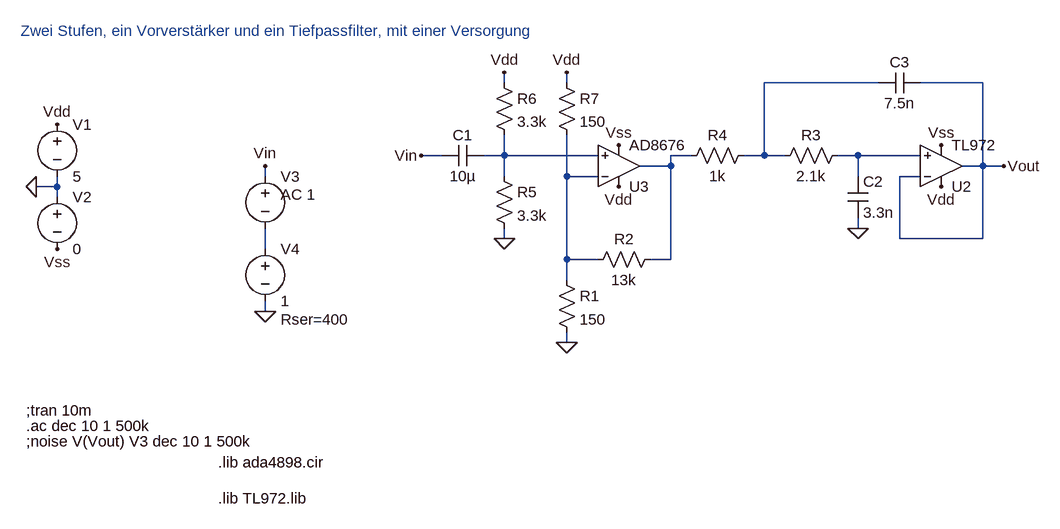
[diagram p0: schematic zwei_stufen_einfachversorgung.asc]
zwei_stufen_einfachversorgung.asc, the LTspice schematic file:
Version 4
SHEET 1 1096 5076
WIRE 144 -64 144 -80
WIRE 240 -64 240 -80
WIRE 720 -64 544 -64
WIRE 880 -64 784 -64
WIRE 48 48 16 48
WIRE 144 48 144 16
WIRE 144 48 112 48
WIRE 288 48 144 48
WIRE 432 48 400 48
WIRE 544 48 544 -64
WIRE 544 48 512 48
WIRE 576 48 544 48
WIRE 688 48 656 48
WIRE 784 48 688 48
WIRE 400 64 400 48
WIRE 400 64 352 64
WIRE 880 64 880 -64
WIRE 880 64 848 64
WIRE 912 64 880 64
WIRE -224 80 -224 64
WIRE 144 80 144 48
WIRE 240 80 240 16
WIRE 288 80 240 80
WIRE 688 80 688 48
WIRE 784 80 752 80
WIRE -544 96 -544 80
WIRE -544 96 -576 96
WIRE -544 112 -544 96
WIRE 688 160 688 144
WIRE 144 176 144 160
WIRE 752 176 752 80
WIRE 880 176 880 64
WIRE 880 176 752 176
WIRE -224 192 -224 160
WIRE 240 208 240 80
WIRE 288 208 240 208
WIRE 400 208 400 64
WIRE 400 208 368 208
WIRE 240 240 240 208
WIRE -224 288 -224 272
WIRE 240 336 240 320
FLAG -544 0 Vdd
FLAG -576 96 0
FLAG -544 192 Vss
FLAG 320 96 Vdd
FLAG 320 32 Vss
FLAG 240 336 0
FLAG -224 288 0
FLAG 16 48 Vin
FLAG -224 64 Vin
FLAG 816 96 Vdd
FLAG 816 32 Vss
FLAG 688 160 0
FLAG 912 64 Vout
FLAG 144 176 0
FLAG 144 -80 Vdd
FLAG 240 -80 Vdd
SYMBOL voltage -544 -16 R0
WINDOW 123 0 0 Left 0
WINDOW 39 0 0 Left 0
SYMATTR InstName V1
SYMATTR Value 5
SYMBOL voltage -544 96 R0
WINDOW 123 0 0 Left 0
WINDOW 39 0 0 Left 0
SYMATTR InstName V2
SYMATTR Value 0
SYMBOL res 224 224 R0
SYMATTR InstName R1
SYMATTR Value 150
SYMBOL res 384 192 R90
WINDOW 0 0 56 VBottom 2
WINDOW 3 32 56 VTop 2
SYMATTR InstName R2
SYMATTR Value 13k
SYMBOL voltage -224 64 R0
WINDOW 3 24 96 Invisible 2
WINDOW 123 24 44 Left 2
WINDOW 39 0 0 Left 0
SYMATTR Value SINE(0 10m 1k)
SYMATTR Value2 AC 1
SYMATTR InstName V3
SYMBOL voltage -224 176 R0
WINDOW 123 0 0 Left 0
WINDOW 39 24 124 Left 2
SYMATTR SpiceLine Rser=400
SYMATTR InstName V4
SYMATTR Value 1
SYMBOL cap 112 32 R90
WINDOW 0 0 32 VBottom 2
WINDOW 3 32 32 VTop 2
SYMATTR InstName C1
SYMATTR Value 10µ
SYMBOL cap 672 80 R0
SYMATTR InstName C2
SYMATTR Value 3.3n
SYMBOL res 672 32 R90
WINDOW 0 0 56 VBottom 2
WINDOW 3 32 56 VTop 2
SYMATTR InstName R3
SYMATTR Value 2.1k
SYMBOL res 528 32 R90
WINDOW 0 0 56 VBottom 2
WINDOW 3 32 56 VTop 2
SYMATTR InstName R4
SYMATTR Value 1k
SYMBOL cap 784 -80 R90
WINDOW 0 0 32 VBottom 2
WINDOW 3 32 32 VTop 2
SYMATTR InstName C3
SYMATTR Value 7.5n
SYMBOL res 128 64 R0
SYMATTR InstName R5
SYMATTR Value 3.3k
SYMBOL res 128 -80 R0
SYMATTR InstName R6
SYMATTR Value 3.3k
SYMBOL res 224 -80 R0
SYMATTR InstName R7
SYMATTR Value 150
SYMBOL OpAmps\\opamp2 816 128 M180
SYMATTR InstName U2
SYMATTR Value TL972
SYMBOL OpAmps\\AD8676 320 128 M180
SYMATTR InstName U3
TEXT -592 440 Left 2 !;tran 10m
TEXT -592 464 Left 2 !.ac dec 10 1 500k
TEXT -600 -144 Left 2 ;Zwei Stufen, ein Vorverstärker und ein Tiefpassfilter, mit einer Versorgung
TEXT -592 488 Left 2 !;noise V(Vout) V3 dec 10 1 500k
TEXT -296 576 Left 2 !.lib TL972.lib
TEXT -296 520 Left 2 !.lib ada4898.cir

The netlist it stands for:
* zwei_stufen_einfachversorgung.asc
V1 Vdd 0 5
V2 0 Vss 0
R1 N005 0 150
R2 N003 N005 13k
V3 Vin N006 SINE(0 10m 1k) AC 1
V4 N006 0 1 Rser=400
C1 N002 Vin 10µ
C2 N004 0 3.3n
R3 N004 N001 2.1k
R4 N001 N003 1k
C3 Vout N001 7.5n
R5 N002 0 3.3k
R6 Vdd N002 3.3k
R7 Vdd N005 150
XU2 N004 Vout Vdd Vss Vout TL972  ; pins In+ In- V+ V- OUT
XU3 N002 N005 Vdd Vss N003 AD8676  ; pins In+ In- V+ V- OUT
;tran 10m
.ac dec 10 1 500k
* Zwei Stufen, ein Vorverstärker und ein Tiefpassfilter, mit einer Versorgung
;noise V(Vout) V3 dec 10 1 500k
.lib TL972.lib
.lib ada4898.cir
.backanno
.end